# Altium schematic sheet Connectors&TestPoints.SchDoc: Go Cart Connectors
size A3; DrawnBy: Hassan Alhujhoj; Address1: ECE Department; Address2: University of Canterbury; Address3: Christchurch 8041; Address4: New Zealand
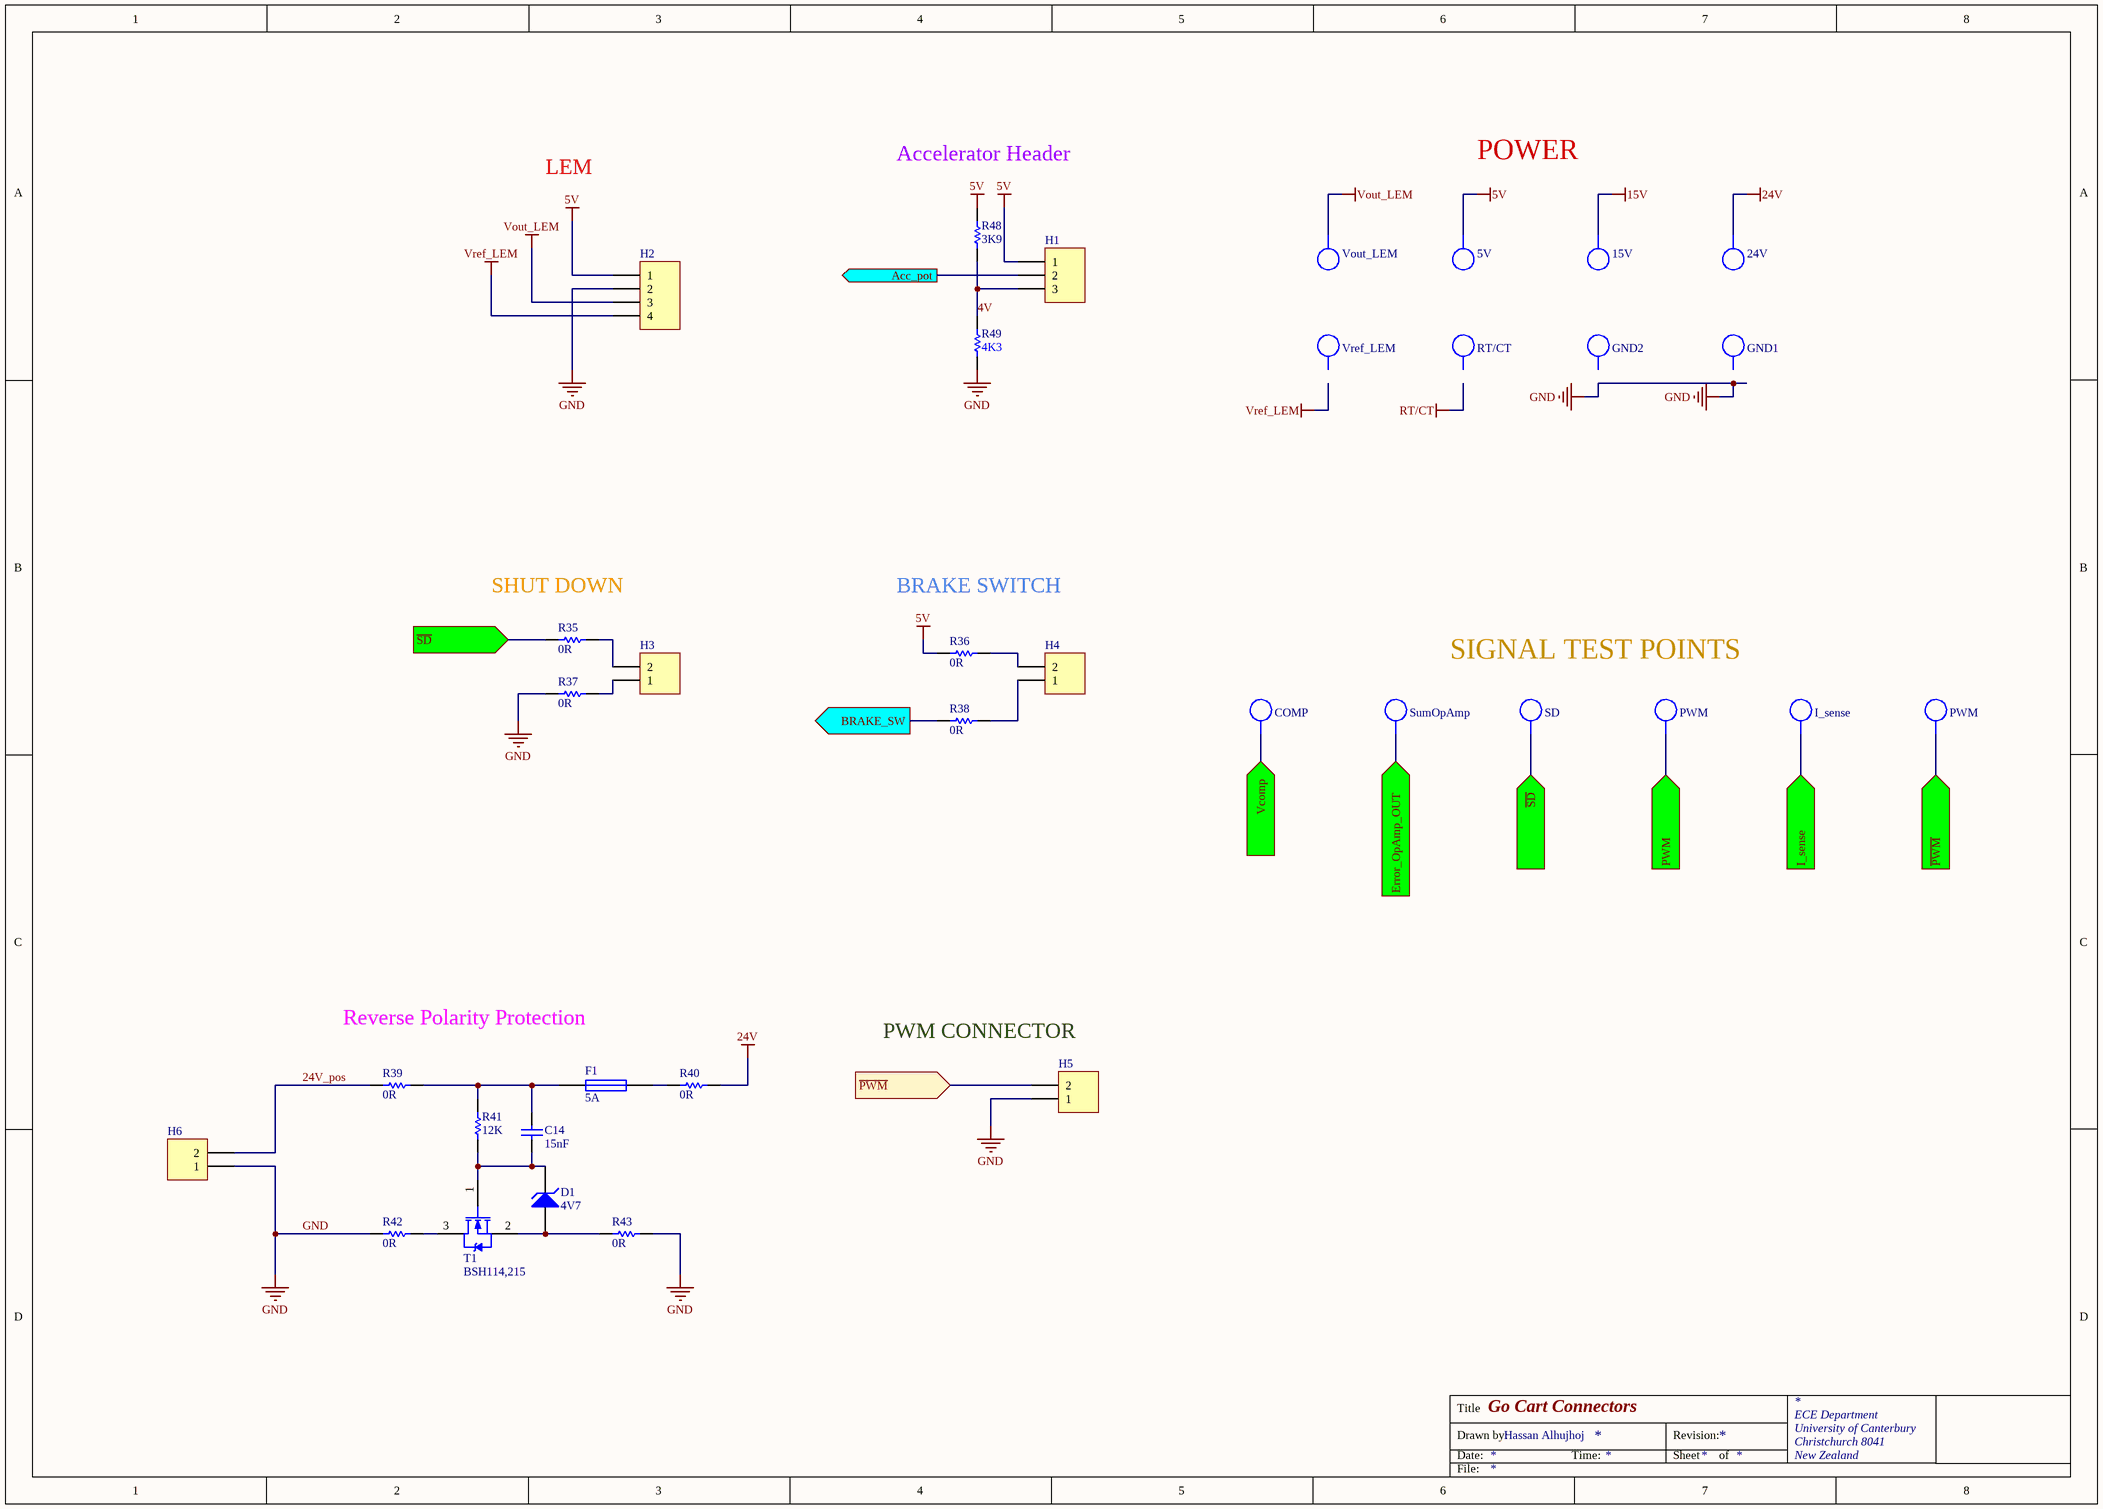
[diagram p0: Connectors&TestPoints.SchDoc]

## Parts
(Parts that share a designator on the sheet are numbered #1, #2 ... from top to bottom, then left to right.)
5V  TP  [TP_1206]  (value not drawn)  (no BOM)
15V  TP  [TP_1206]  (value not drawn)  (no BOM)
24V  TP  [TP_1206]  (value not drawn)  (no BOM)
C14  15nF  [CAPC1608L]
COMP  TP  [TP_1206]  (value not drawn)  (no BOM)
D1  4V7  [SOT23_L]
F1  5A  [RESC3216N]
GND1  TP  [TP_1206]  (value not drawn)  (no BOM)
GND2  TP  [TP_1206]  (value not drawn)  (no BOM)
H1  3 Pin Molex KK Hdr  [MOLEX_KK_3_HDR]  (value not drawn)
H2  4 Pin Molex KK Hdr  [MOLEX_KK_4_HDR]  (value not drawn)
H3  2 Pin Molex KK HDR  [MOLEX_KK_2_HDR]  (value not drawn)
H4  2 Pin Molex KK HDR  [MOLEX_KK_2_HDR]  (value not drawn)
H5  2 Pin Molex KK HDR  [MOLEX_KK_2_HDR]  (value not drawn)
H6  2 Pin Molex KK HDR  [MOLEX_KK_2_HDR]  (value not drawn)
I_sense  TP  [TP_1206]  (value not drawn)  (no BOM)
PWM#1  TP  [TP_1206]  (value not drawn)  (no BOM)
PWM#2  TP  [TP_1206]  (value not drawn)  (no BOM)
R35  0R  [RESC1608L]
R36  0R  [RESC1608L]
R37  0R  [RESC1608L]
R38  0R  [RESC1608L]
R39  0R  [RESC1608L]
R40  0R  [RESC1608L]
R41  12K  [RESC1608L]
R42  0R  [RESC1608L]
R43  0R  [RESC1608L]
R48  3K9  [RESC1608L]
R49  4K3  [RESC1608L]
RT/CT  TP  [TP_1206]  (value not drawn)  (no BOM)
SD  TP  [TP_1206]  (value not drawn)  (no BOM)
SumOpAmp  TP  [TP_1206]  (value not drawn)  (no BOM)
T1  BSH114,215  [SOT23_L]
Vout_LEM  TP  [TP_1206]  (value not drawn)  (no BOM)
Vref_LEM  TP  [TP_1206]  (value not drawn)  (no BOM)

## Ports
Acc_pot (out), BRAKE_SW (out), Error_OpAmp_OUT (in), I_sense (in), PWM (in), Vcomp (in), ~{PWM} (in), ~{SD} (in)

## Nets
5V: 5V.1 H1.1 H2.1 R36.1 R48.2
15V: 15V.1
24V: 24V.1 R40.2
GND: H2.2 H5.1 H6.1 R37.1 R42.1 R43.2 R49.1
Vout_LEM: H2.3 Vout_LEM.1
Vref_LEM: H2.4
4V: H1.3 R48.1 R49.2
24V_pos: H6.2 R39.1
Acc_pot: H1.2 ; port Acc_pot
BRAKE_SW: R38.1 ; port BRAKE_SW
Error_OpAmp_OUT: SumOpAmp.1 ; port Error_OpAmp_OUT
I_sense: I_sense.1 ; port I_sense
~{PWM}: H5.2 PWM#2.1 ; port ~{PWM}
PWM: PWM#1.1 ; port PWM
~{SD}: R35.1 SD.1 ; port ~{SD}
Vcomp: COMP.1 ; port Vcomp
NetC14_1: C14.1 D1.3(K) R41.1 T1.1
NetC14_2: C14.2 F1.1 R39.2 R41.2
NetD1_1: D1.1(A) R43.1 T1.2
NetF1_2: F1.2 R40.1
NetH3_1: H3.1 R37.2
NetH3_2: H3.2 R35.2
NetH4_1: H4.1 R38.2
NetH4_2: H4.2 R36.2
NetR42_2: R42.2 T1.3

Not connected (* = marked no-connect by the designer): GND1 1; GND2 1; RT/CT 1; Vref_LEM 1

## Notes on the sheet
- LEM
- Accelerator Header
- POWER
- (near R35) SHUT DOWN
- BRAKE SWITCH
- SIGNAL TEST POINTS
- Reverse Polarity Protection
- (near H5) PWM CONNECTOR
- Title
- Drawn by:
- Date:
- Time:
- Revision:
- Sheet
- of
- File:

## Library data of the parts
5V 15V 24V COMP GND1 GND2 I_sense PWM#1 PWM#2 RT/CT SD SumOpAmp Vout_LEM Vref_LEM = TP_1206: Test-Point 3.3x1.6x2.1mm SMD; Manufacturer: Harwin Inc; Manufacturer Part Number: S1751-46R; Manufacturer PN: *; Storage Location: ProtoPlace; Mounting Type: Surface Mount; Type: PC Test Point; Supplier 1: Digi-Key; Supplier Part Number 1: 952-1478-2-ND; Supplier 2: Farnell; Supplier Part Number 2: 1826282; Supplier: ECE Dept; Value: TP
C14 = CC_15nF_0603: CAP CER 15nF X7R +-10% 50V 0603; PackageReference: 0603; Code_IPC: 1608 [0603]; Verify: *; Supplier: ECE Dept; Storage Location: PCB Assembly WS; Value: 15nF
D1 = DZ_4.7V: BZX84C4V7LT1G - DIODE, ZENER, 4.7V, 225MW, SOT23; Manufacturer: ON SEMICONDUCTOR; Breakdown Voltage Max: 5; Breakover Voltage Min: 4.7; Diode Case Style: SOT-23; Power Dissipation Pd: 225; Supplier 1: Farnell; Supplier 2: Digi-Key; Supplier Part Number 1: 1459051; Supplier Part Number 2: BZX84C4V7LT1GOSCT-ND; Manufacturer Part Number: BZX84C4V7LT1G
F1 = FS_Fuse_5.0A: Fuse 5.0A Fast Acting 1206 SMD; Manufacturer: Bel TRP; Manufacturer Part Number: C1F5; Voltage Rating (AC): 125V; Voltage Rating (DC): 63V; DC Cold Resistance: 19mR; Fuse Type: Board Mount (Cartridge Style Excluded); Approvals: CE,cURus; Supplier 1: Digi-Key; Supplier 2: Element14; Current Rating: 5A; Supplier Part Number 2: 2848595; Supplier Part Number 1: 507-1886-1-ND; Value: 5A; Mount: Surface Mount; Case/Package: 1206; Number of Pins: 2; Case Code (Metric): 3216; Case Code (Imperial): 1206; Contact Plating: Nickel,Tin; Min Operating Temperature: -55°C; Max Operating Temperature: 125°C; Packaging: Tape and Reel; Voltage Rating: 125V; Length: 0.126inch; Width: 0.062inch; Stock 1: 725; Pricing 1: 1=0.32, 5=0.312, 10=0.298, 50=0.2662, 100=0.2479, 250=0.22032, 500=0.1836, 1000=0.17442 (USD); ComponentLink1URL: http://www.farnell.com/datasheets/2571625.pdf; ComponentLink1Description: http://www.farnell.com/datasheets/2571625.pdf; ComponentLink2URL: http://belfuse.com/pdfs/C1F.pdf; ComponentLink2Description: http://belfuse.com/pdfs/C1F.pdf; ComponentLink3URL: http://www.mouser.com/ds/2/643/C1F-594910.pdf; ComponentLink3Description: http://www.mouser.com/ds/2/643/C1F-594910.pdf; ComponentLink4URL: https://belfuse.com/resources/StewartConnector/C1F.pdf; ComponentLink4Description: https://belfuse.com/resources/StewartConnector/C1F.pdf
H1 = JA_MOLEX_KK_3POS: CONN HEADER 3POS 2.54mm VERT_Thru Hole; Manufacturer: Molex; Manufacturer PN: 22-23-2031; Supplier Part Number 1: 9731156; Supplier: ECE Dept; Supplier 1: Farnell; Storage Location: ECE Dept Store; Value: 3 Pin Molex KK Hdr
H2 = JA_MOLEX_KK_4POS: CONN HEADER 4POS 2.54mm VERT_Thru Hole; Manufacturer: Molex; Manufacturer PN: 22-23-2041; Supplier Part Number 1: 9731164; Supplier: ECE Dept; Supplier 1: Farnell; Storage Location: ECE Dept Store; Value: 4 Pin Molex KK Hdr
H3-H6 = JA_MOLEX_KK_2POS: CONN HEADER 2POS 2.54mm VERT_Thru Hole; Supplier 1: Farnell; Supplier Part Number 1: 1462926; Supplier: ECE Dept; Storage Location: ECE Dept Store; Value: 2 Pin Molex KK HDR
R35-R40 R42 R43 = RS_0R0: RES 0.0 OHM 1/10W 5% 0603 SMD; Storage Location: PCB Assembly WS; Supplier: ECE Dept; Value: 0R
R41 = RS_12K: RES 12K OHM 1/10W 5% 0603 SMD; Storage Location: PCB Assembly WS; Supplier: ECE Dept; Value: 12K
R48 = RS_3K9: RES 3.9K OHM 1/10W 5% 0603 SMD; Storage Location: PCB Assembly WS; Supplier: ECE Dept; Value: 3K9
R49 = RS_4K3: RES 4.3K OHM 1/10W 5% 0603 SMD; Storage Location: PCB Assembly WS; Supplier: ECE Dept; Value: 4K3
T1 = TM_BSH114: MOSFET N-CH 100V 0.85A SOT-23; Continuous Drain Current Id: 500; Current Id Max: 850; Drain Source Voltage Vds: 100; Power Dissipation Pd: 830; Transistor Type: Enhancement; Voltage Vds Typ: 130; Voltage Vgs Max: 3; Voltage Vgs Rds on Measurement: 10; Transistor Case Style: SOT-23; Supplier 1: Farnell; Supplier Part Number 1: 1758071RL; Manufacturer Part Number: BSH114,215